# Altium schematic sheet Half-Bridge.SchDoc
size A4; DocumentNumber: 2; SheetNumber: 2; SheetTotal: 5
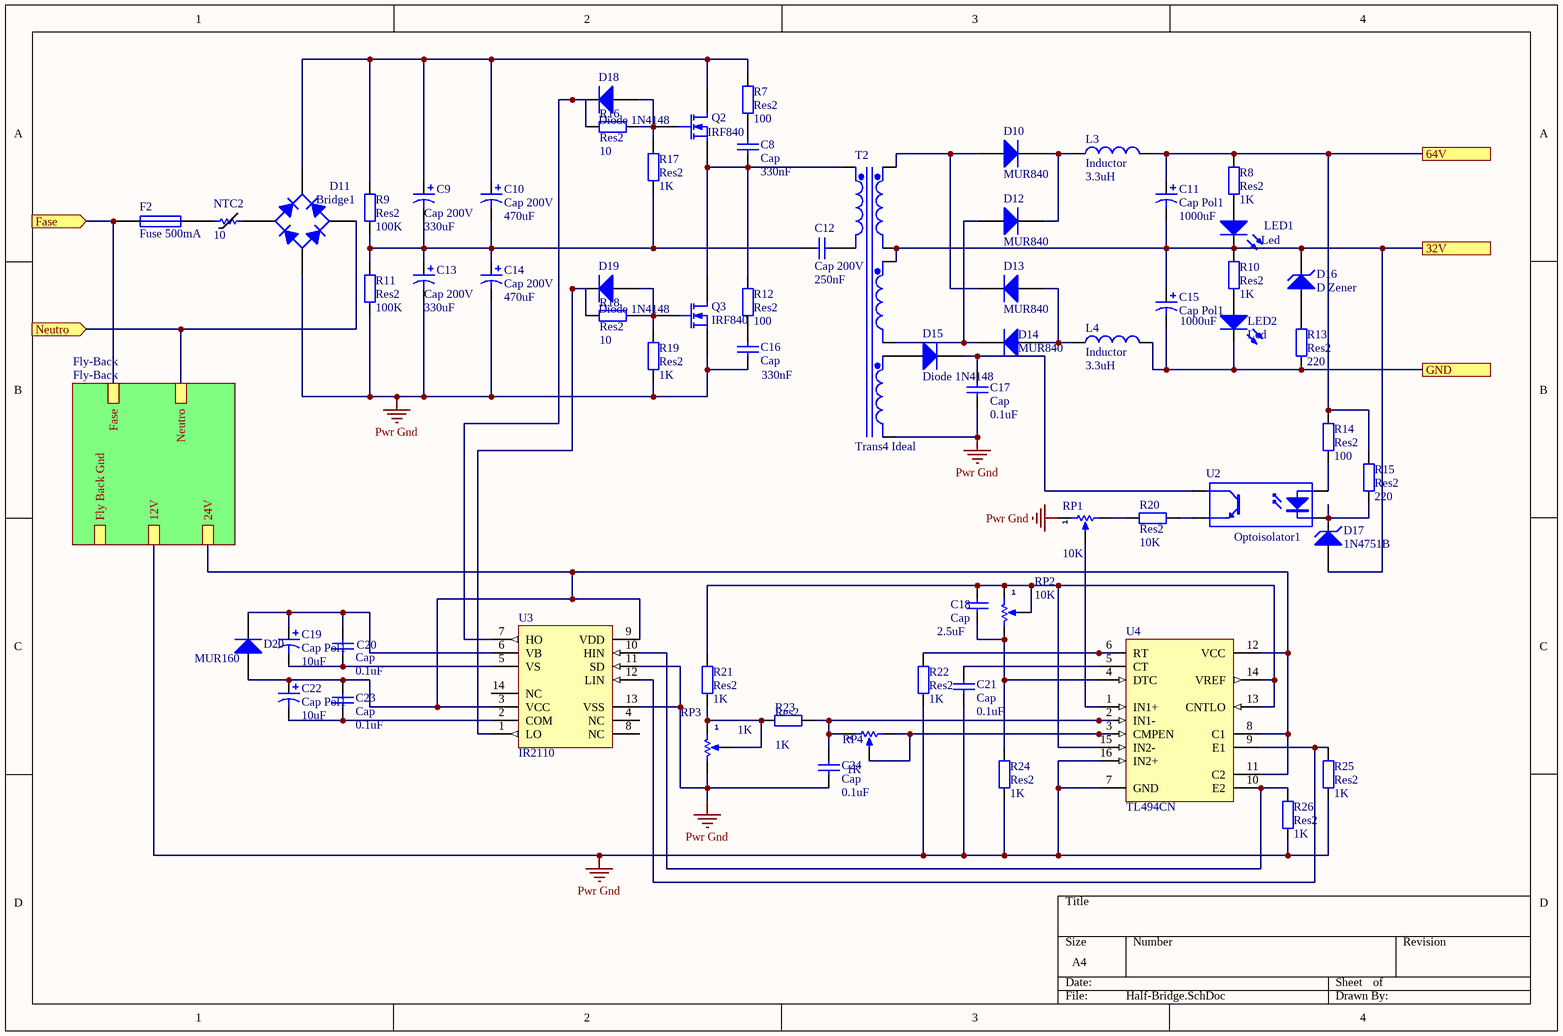
[diagram p0: Half-Bridge.SchDoc]

## Parts
C8  Cap  value 330nF  [RAD-0.3]
C9  Cap 200V  value 330uF  [RB7.6-15]
C10  Cap 200V  value 470uF  [RB7.6-15]
C11  Cap Pol1  value 1000uF  [RB7.6-15]
C12  Cap 200V  value 250nF  [RAD-0.3]
C13  Cap 200V  value 330uF  [RB7.6-15]
C14  Cap 200V  value 470uF  [RB7.6-15]
C15  Cap Pol1  value 1000uF  [RB7.6-15]
C16  Cap  value 330nF  [RAD-0.3]
C17  Cap  value 0.1uF  [RAD-0.3]
C18  Cap  value 2.5uF  [RAD-0.3]
C19  Cap Pol1  value 10uF  [RB7.6-15]
C20  Cap  value 0.1uF  [RAD-0.3]
C21  Cap  value 0.1uF  [RAD-0.3]
C22  Cap Pol1  value 10uF  [RB7.6-15]
C23  Cap  value 0.1uF  [RAD-0.3]
C24  Cap  value 0.1uF  [RAD-0.3]
D10  MUR840  [DO-35]
D11  Bridge1  [D-38]
D12  MUR840  [DO-35]
D13  MUR840  [DO-35]
D14  MUR840  [DO-35]
D15  Diode 1N4148  [DO-35]
D16  D Zener  [DIODE-0.7]
D17  1N4751B  [DIODE-0.7]
D18  Diode 1N4148  [DO-35]
D19  Diode 1N4148  [DO-35]
D20  MUR160  [DO-35]
F2  Fuse 500mA  [PIN-W2/E2.8]
L3  Inductor  value 3.3uH  [0402-A]
L4  Inductor  value 3.3uH  [0402-A]
LED1  VALOR: Led  [Led 3mm AMARILLO]  (hidden comment: Diodo Led)
LED2  VALOR: Led  [Led 3mm AMARILLO]  (hidden comment: Diodo Led)
NTC2  VALOR: 10  [R0805]  (hidden comment: Termistor NTC)
Q2  IRF840  [E3]
Q3  IRF840  [E3]
R7  Res2  value 100  [AXIAL-0.4]
R8  Res2  value 1K  [AXIAL-0.4]
R9  Res2  value 100K  [AXIAL-0.4]
R10  Res2  value 1K  [AXIAL-0.4]
R11  Res2  value 100K  [AXIAL-0.4]
R12  Res2  value 100  [AXIAL-0.4]
R13  Res2  value 220  [AXIAL-0.4]
R14  Res2  value 100  [AXIAL-0.4]
R15  Res2  value 220  [AXIAL-0.4]
R16  Res2  value 10  [AXIAL-0.4]
R17  Res2  value 1K  [AXIAL-0.4]
R18  Res2  value 10  [AXIAL-0.4]
R19  Res2  value 1K  [AXIAL-0.4]
R20  Res2  value 10K  [AXIAL-0.4]
R21  Res2  value 1K  [AXIAL-0.4]
R22  Res2  value 1K  [AXIAL-0.4]
R23  Res2  value 1K  [AXIAL-0.4]
R24  Res2  value 1K  [AXIAL-0.4]
R25  Res2  value 1K  [AXIAL-0.4]
R26  Res2  value 1K  [AXIAL-0.4]
RP1  VALOR: 10K  [Trimpot Multivuelta Horizontal]  (hidden comment: Trimpot)
RP2  VALOR: 10K  [Trimpot Multivuelta Horizontal]  (hidden comment: Trimpot)
RP3  VALOR: 1K  [Trimpot Multivuelta Horizontal]  (hidden comment: Trimpot)
RP4  VALOR: 1K  [Trimpot Multivuelta Horizontal]  (hidden comment: Trimpot)
T2  Trans4 Ideal  [TRF_8]
U2  Optoisolator1  [DIP-4]
U3  IR2110  [PDIP14]
U4  TL494CN  [DIP-16]

## Sub-sheets
Fly-Back = Fly-Back: 24V, 12V, Fly Back Gnd, Fase, Neutro

## Ports
32V, 64V, Fase (in), GND, Neutro (in)

## Nets
Pwr Gnd: C13.2 C14.2 C16.1 C17.1 C21.1 C24.1 D11.3(A) Q3.3(S) R11.1 R19.2 R22.1 R24.1 R25.1 R26.1 RP1.1(TOP) RP3.2(BOT) T2.8(Sec3-) U3.11(SD) U3.13(VSS) U4.7(GND) U4.16(IN2+) ; sheet Fly-Back/12V
32V: C11.2 C15.1 D16.2(K) D17.1(A) LED1.2(K) R10.2 T2.4(Sec1-) T2.5(Sec2+) ; port 32V
64V: C11.1 L3.2 R8.2 R14.2 R15.2 ; port 64V
Fase: F2.1 ; port Fase, sheet Fly-Back/Fase
GND: C15.2 L4.2 LED2.2(K) R13.1 ; port GND
Neutro: D11.2(C) ; port Neutro, sheet Fly-Back/Neutro
NetC8_1: C8.1 Q2.3(S) Q3.1(D) R12.2 T2.1(Pri+)
NetC8_2: C8.2 R7.1
NetC9_1: C9.1 C10.1 D11.1(K) Q2.1(D) R7.2 R9.2
NetC9_2: C9.2 C10.2 C12.1 C13.1 C14.1 R9.1 R11.2 R17.1
NetC12_2: C12.2 T2.2(Pri-)
NetC16_2: C16.2 R12.1
NetC17_2: C17.2 D15.2(K) U2.4(C)
NetC18_1: C18.1 R24.2 RP2.2(BOT) U4.4(DTC)
NetC18_2: C18.2 R21.2 RP2.1(TOP) RP2.3(TAP) U4.13(CNTLO) U4.14(VREF) U4.15(IN2-)
NetC19_1: C19.1 C20.2 D20.2(K) U3.6(VB)
NetC19_2: C19.2 C20.1 U3.5(VS)
NetC21_2: C21.2 U4.5(CT)
NetC22_1: C22.1 C23.2 D20.1(A) U3.3(VCC) U3.9(VDD) U4.8(C1) U4.11(C2) U4.12(VCC) ; sheet Fly-Back/24V
NetC22_2: C22.2 C23.1 U3.2(COM)
NetC24_2: C24.2 R23.2 RP4.1(TOP) U4.2(IN1-)
NetD10_1: D10.1(A) D13.2(K) T2.3(Sec1+)
NetD10_2: D10.2(K) D12.2(K) L3.1
NetD11_4: D11.4(C) NTC2.1
NetD12_1: D12.1(A) D14.2(K) T2.6(Sec2-)
NetD13_1: D13.1(A) D14.1(A) L4.1
NetD15_1: D15.1(A) T2.7(Sec3+)
NetD16_1: D16.1(A) R13.2
NetD17_2: D17.2(K) R15.1 U2.2(K)
NetD18_1: D18.1(A) Q2.2(G) R16.2 R17.2
NetD18_2: D18.2(K) R16.1 U3.7(HO)
NetD19_1: D19.1(A) Q3.2(G) R18.1 R19.1
NetD19_2: D19.2(K) R18.2 U3.1(LO)
NetF2_2: F2.2 NTC2.2
NetLED1_1: LED1.1(A) R8.1
NetLED2_1: LED2.1(A) R10.1
NetR14_1: R14.1 U2.1(A)
NetR20_1: R20.1 U2.3(E)
NetR20_2: R20.2 RP1.2(BOT)
NetR21_1: R21.1 R23.1 RP3.1(TOP) RP3.3(TAP)
NetR22_2: R22.2 U4.6(RT)
NetR25_2: R25.2 U3.12(LIN) U4.9(E1)
NetR26_2: R26.2 U3.10(HIN) U4.10(E2)
NetRP1_3: RP1.3(TAP) U4.1(IN1+)
NetRP4_2: RP4.2(BOT) RP4.3(TAP) U4.3(CMPEN)

Not connected (* = marked no-connect by the designer): U3 4(NC) 8(NC) 14(NC)

## Library data of the parts
C8 C12 C16-C18 C20 C21 C23 C24 = Cap: Capacitor; Published: 8-Jun-2000; LatestRevisionDate: 17-Jul-2002; LatestRevisionNote: Re-released for DXP Platform.; PackageReference: RAD-0.3; Publisher: Altium Limited; PackageDescription: Radial Cap, Thru-Hole; 2 Leads; 0.3 in Pin Spacing
C9-C11 C13-C15 C19 C22 = Cap Pol1: Polarized Capacitor (Radial); Published: 8-Jun-2000; LatestRevisionDate: 17-Jul-2002; LatestRevisionNote: Re-released for DXP Platform.; PackageReference: RB7.6-15; Publisher: Altium Limited; PackageDescription: Polarized Capacitor (Radial); 2 Leads
D10 D12-D15 D18-D20 = Diode 1N4148: High Conductance Fast Diode; Published: 8-Jun-2000; LatestRevisionDate: 17-Jul-2002; LatestRevisionNote: Re-released for DXP Platform.; DatasheetVersion: 1997; PackageReference: DO-35; Publisher: Altium Limited; PackageDescription: Diode, Axial; Body 3.8 x 1.9 mm (LxDia. max), Lead Dia. 0.53 mm (max); Code_JEDEC: DO-204-AH; ComponentLink1Description: Manufacturer Link; ComponentLink1URL: http://www.fairchildsemi.com/; ComponentLink2Description: Datasheet; ComponentLink2URL: http://www.fairchildsemi.com/ds/1N%2F1N4148.pdf
D11 = Bridge1: Full Wave Diode Bridge; Published: 8-Jun-2000; LatestRevisionDate: 29-May-2009; LatestRevisionNote: Sch pins A & K swapped.; DatasheetVersion: E2732B; PackageReference: D-38; Publisher: Altium Limited; PackageDescription: Bridge Rectifier; 4 Terminals; Body 9.4 x 9.4 mm (typ); Pitch 5.08 mm
D16 D17 = D Zener: Zener Diode; Published: 8-Jun-2000; LatestRevisionDate: 17-Jul-2002; LatestRevisionNote: Re-released for DXP Platform.; PackageReference: DIODE-0.7; Publisher: Altium Limited; PackageDescription: Diode, Thru-Hole; 2 Leads; 0.7 in Pin Spacing
F2 = Fuse 1: Fuse; Published: 8-Jun-2000; LatestRevisionDate: 17-Jul-2002; LatestRevisionNote: Re-released for DXP Platform.; PackageReference: PIN-W2/E2.8; Publisher: Altium Limited; PackageDescription: Thru-Hole; 2 Leads
L3 L4 = Inductor: Code_IEC: 1005; Published: 8-Jun-2000; LatestRevisionDate: 29-May-2009; LatestRevisionNote: IPC-7351 Footprint Added.; PackageReference: 0402-A; Publisher: Altium Limited; PackageDescription: Chip Inductor; Code_JEITA: 0402
LED1 LED2 = Diodo Led: Led 3mm; CODIGO STI: *; PROVEEDOR: *; FABRICANTE: *
NTC2 = Termistor NTC: Termistor NTC SMD; PROVEEDOR: *; CODIGO STI: *; FABRICANTE: *
Q2 Q3 = MOSFET-N: N-Channel MOSFET; Published: 8-Jun-2000; LatestRevisionDate: 17-Jul-2002; LatestRevisionNote: Re-released for DXP Platform.; PackageVersion: 1995/1996; PackageReference: E3; Publisher: Altium Limited; PackageDescription: TO, Flat Index; 3 In-Line, Axial Leads; Body Dia. 4.6mm; Lead Dia. 0.5 mm (max)
R7-R26 = Res2: Resistor; Published: 8-Jun-2000; LatestRevisionDate: 17-Jul-2002; LatestRevisionNote: Re-released for DXP Platform.; PackageReference: AXIAL-0.4; Publisher: Altium Limited; PackageDescription: Axial Device, Thru-Hole; 2 Leads; 0.4 in Pin Spacing
RP1-RP4 = Trimpot: Preset; CODIGO STI: *; PROVEEDOR: *; FABRICANTE: *
  RP1: PART NUMBER: *
T2 = Trans4 Ideal: Four-winding Transformer (Ideal); Published: 25-Jan-2001; LatestRevisionDate: 17-Jul-2002; LatestRevisionNote: Re-released for DXP Platform.; PackageReference: TRF_8; Publisher: Altium Limited; PackageDescription: Transformer; 8 Leads
U2 = Optoisolator1: 4-Pin Phototransistor Optocoupler; Published: 24-Mar-1999; LatestRevisionDate: 04-Mar-2005; LatestRevisionNote: Sch pins 3 & 4 Swapped.; DatasheetVersion: Nov-2003; PackageReference: DIP-4; Publisher: Altium Limited
U3 = IR2110: High and Low Side Driver; Note: Pins 4, 8 and 14 are not connected; Published: 8-Jun-2000; LatestRevisionDate: 04-Mar-2005; LatestRevisionNote: Stylized 3D Model Added.; DatasheetVersion: PD60147J; PackageReference: PDIP14; Publisher: Altium Limited; PackageDescription: DIP; 14 Leads; Row Spacing 7.62 mm; Pitch 2.54 mm; ComponentLink1Description: Manufacturer Link; ComponentLink1URL: http://www.irf.com/; ComponentLink2Description: Datasheet; ComponentLink2URL: http://www.irf.com/product-info/datasheets/data/ir2110.pdf
U4 = TL494CN: Switchmode Pulse Width Modulation Control Circuit; Published: 15-Apr-2002; DatasheetVersion: 1996; PackageVersion: Apr-2000; PackageReference: 648-08; Publisher: Altium Limited; PackageDescription: DIP; 16 Leads; Row Spacing 7.62 mm; Pitch 2.54 mm; Code_JEDEC: MS-001-BB; ComponentLink1Description: Manufacturer Link; ComponentLink1URL: http://www.onsemi.com/site/products/taxonomy/0,4438,503,00.html; ComponentLink2Description: Datasheet; ComponentLink2URL: http://www.onsemi.com/pub/Collateral/TL494-D.PDF